# EAGLE design capmodule (EAGLE 8.2.1)
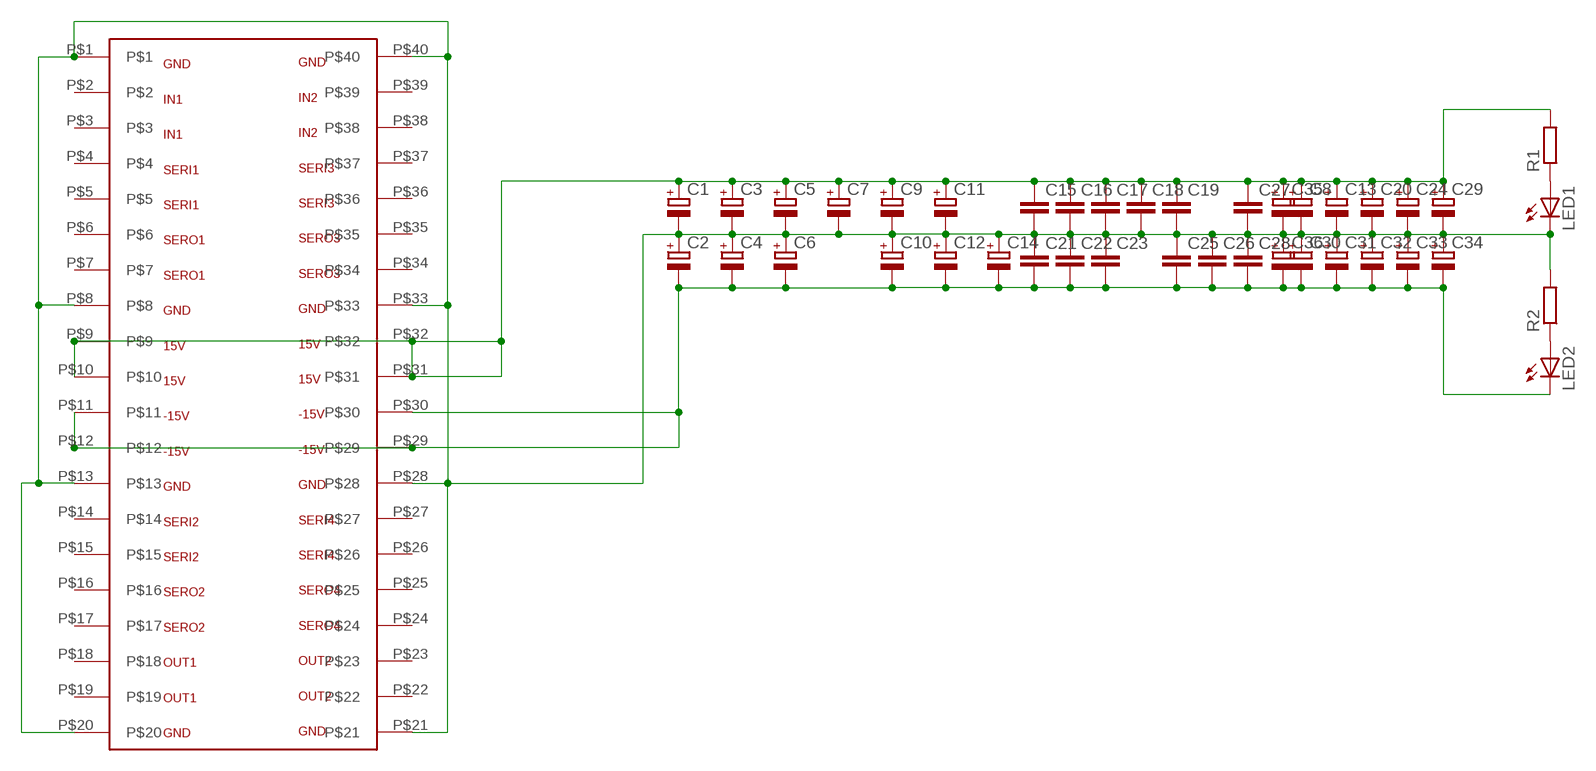
[diagram p0: schematic, sheet 1]

## Parts
C1  CPOL-EUE3.5-8  [E3,5-8]
C2  CPOL-EUE3.5-8  [E3,5-8]
C3  CPOL-EUE3.5-8  [E3,5-8]
C4  CPOL-EUE3.5-8  [E3,5-8]
C5  CPOL-EUE3.5-8  [E3,5-8]
C6  CPOL-EUE3.5-8  [E3,5-8]
C7  CPOL-EUE3.5-8  [E3,5-8]
C8  CPOL-EUSP-CAP-CX  [SP-CAP-CX]
C9  CPOL-EUE3.5-8  [E3,5-8]
C10  CPOL-EUE3.5-8  [E3,5-8]
C11  CPOL-EUE3.5-8  [E3,5-8]
C12  CPOL-EUE3.5-8  [E3,5-8]
C13  CPOL-EUSP-CAP-CX  [SP-CAP-CX]
C14  CPOL-EUE3.5-8  [E3,5-8]
C15  C-EU050-035X075  [C050-035X075]
C16  C-EU050-035X075  [C050-035X075]
C17  C-EU050-035X075  [C050-035X075]
C18  C-EU050-035X075  [C050-035X075]
C19  C-EU050-035X075  [C050-035X075]
C20  CPOL-EUSP-CAP-CX  [SP-CAP-CX]
C21  C-EU050-035X075  [C050-035X075]
C22  C-EU050-035X075  [C050-035X075]
C23  C-EU050-035X075  [C050-035X075]
C24  CPOL-EUSP-CAP-CX  [SP-CAP-CX]
C25  C-EU050-035X075  [C050-035X075]
C26  C-EU050-035X075  [C050-035X075]
C27  C-EU050-035X075  [C050-035X075]
C28  C-EU050-035X075  [C050-035X075]
C29  CPOL-EUSP-CAP-CX  [SP-CAP-CX]
C30  CPOL-EUSP-CAP-CX  [SP-CAP-CX]
C31  CPOL-EUSP-CAP-CX  [SP-CAP-CX]
C32  CPOL-EUSP-CAP-CX  [SP-CAP-CX]
C33  CPOL-EUSP-CAP-CX  [SP-CAP-CX]
C34  CPOL-EUSP-CAP-CX  [SP-CAP-CX]
C35  CPOL-EUSP-CAP-CX  [SP-CAP-CX]
C36  CPOL-EUSP-CAP-CX  [SP-CAP-CX]
LED1  LEDSML1206  [SML1206]
LED2  LEDSML1206  [SML1206]
R1  R-EU_MELF0204W  [MINI_MELF-0204W]
R2  R-EU_MELF0204W  [MINI_MELF-0204W]
U$1  VDACA  [VDACA]

## Nets
15V: C1.+ C3.+ C5.+ C7.+ C8.+ C9.+ C11.+ C13.+ C15.1 C16.1 C17.1 C18.1 C19.1 C20.+ C24.+ C27.1 C29.+ C35.+ R1.2 U$1.P$9 U$1.P$10 U$1.P$31 U$1.P$32
-15V: C2.- C4.- C6.- C10.- C12.- C14.- C21.2 C22.2 C23.2 C25.2 C26.2 C28.2 C30.- C31.- C32.- C33.- C34.- C36.- LED2.C U$1.P$11 U$1.P$12 U$1.P$29 U$1.P$30
GND: C1.- C2.+ C3.- C4.+ C5.- C6.+ C7.- C8.- C9.- C10.+ C11.- C12.+ C13.- C14.+ C15.2 C16.2 C17.2 C18.2 C19.2 C20.- C21.1 C22.1 C23.1 C24.- C25.1 C26.1 C27.2 C28.1 C29.- C30.+ C31.+ C32.+ C33.+ C34.+ C35.- C36.+ LED1.C R2.2 U$1.P$1 U$1.P$8 U$1.P$13 U$1.P$20 U$1.P$21 U$1.P$28 U$1.P$33 U$1.P$40
N$1: LED1.A R1.1
N$2: LED2.A R2.1
Unconnected: U$1.P$2 U$1.P$3 U$1.P$4 U$1.P$5 U$1.P$6 U$1.P$7 U$1.P$14 U$1.P$15 U$1.P$16 U$1.P$17 U$1.P$18 U$1.P$19 U$1.P$22 U$1.P$23 U$1.P$24 U$1.P$25 U$1.P$26 U$1.P$27 U$1.P$34 U$1.P$35 U$1.P$36 U$1.P$37 U$1.P$38 U$1.P$39

## Library data of the parts
C1-C14 C20 C24 C29-C36 = Vwvwbg:CPOL-EU: POLARIZED CAPACITOR, European symbol
C15-C19 C21-C23 C25-C28 = Vwvwbg:C-EU: CAPACITOR, European symbol
LED1 LED2 = led:LED: LED OSRAM: - CHIPLED LG R971, LG N971, LY N971, LG Q971, LY Q971, LO R971, LY R971 LH N974, LH R974 LS Q976, LO Q976, LY Q976 LO Q996 - Hyper CHIPLED LW Q18S LB Q993, LB Q99A, LB R99A - SideLED LS A670, LO A670, LY A670, LG A670, LP A670 LB A673, LV A673, LT A673, LW A673 LH A674 LY A675 LS A676, LA A676, LO A676, LY A676, LW A676 LS A679, LY A679, LG A679 - Hyper Micro SIDELED® LS Y876, LA Y876, LO Y876, LY Y876 LT Y87S - SmartLED LW L88C, LW L88S LB L89C, LB L89S, LG L890 LS L89K, LO L89K, LY L89K LS L896, LA L896, LO L896, LY L896 - TOPLED LS T670, LO T670, LY T670, LG T670, LP T670 LSG T670, LSP T670, LSY T670, LOP T670, LYG T670 LG T671, LOG T671, LSG T671 LB T673, LV T673, LT T673, LW T673 LH T674 LS T676, LA T676, LO T676, LY T676, LB T676, LH T676, LSB T676, LW T676 LB T67C, LV T67C, LT T67C, LS T67K, LO T67K, LY T67K, LW E67C LS E67B, LA E67B, LO E67B, LY E67B, LB E67C, LV E67C, LT E67C LW T67C LS T679, LY T679, LG T679 LS T770, LO T770, LY T770, LG T770, LP T770 LB T773, LV T773, LT T773, LW T773 LH T774 LS E675, LA E675, LY E675, LS T675 LS T776, LA T776, LO T776, LY T776, LB T776 LHGB T686 LT T68C, LB T68C - Hyper Mini TOPLED® LB M676 - Mini TOPLED Santana® LG M470 LS M47K, LO M47K, LY M47K Source: http://www.osram.convergy.de LUXEON: - LUMILED® LXK2-PW12-R00, LXK2-PW12-S00, LXK2-PW14-U00, LXK2-PW14-V00 LXK2-PM12-R00, LXK2-PM12-S00, LXK2-PM14-U00 LXK2-PE12-Q00, LXK2-PE12-R00, LXK2-PE12-S00, LXK2-PE14-T00, LXK2-PE14-U00 LXK2-PB12-K00, LXK2-PB12-L00, LXK2-PB12-M00, LXK2-PB14-N00, LXK2-PB14-P00, LXK2-PB14-Q00 LXK2-PR12-L00, LXK2-PR12-M00, LXK2-PR14-Q00, LXK2-PR14-R00 LXK2-PD12-Q00, LXK2-PD12-R00, LXK2-PD12-S00 LXK2-PH12-R00, LXK2-PH12-S00 LXK2-PL12-P00, LXK2-PL12-Q00, LXK2-PL12-R00 Source: www.luxeon.com KINGBRIGHT: KA-3528ASYC Source: www.kingbright.com
R1 R2 = Vwvwbg:R-EU_: RESISTOR, European symbol
U$1 = Vwvwbg:VDACA

## Board
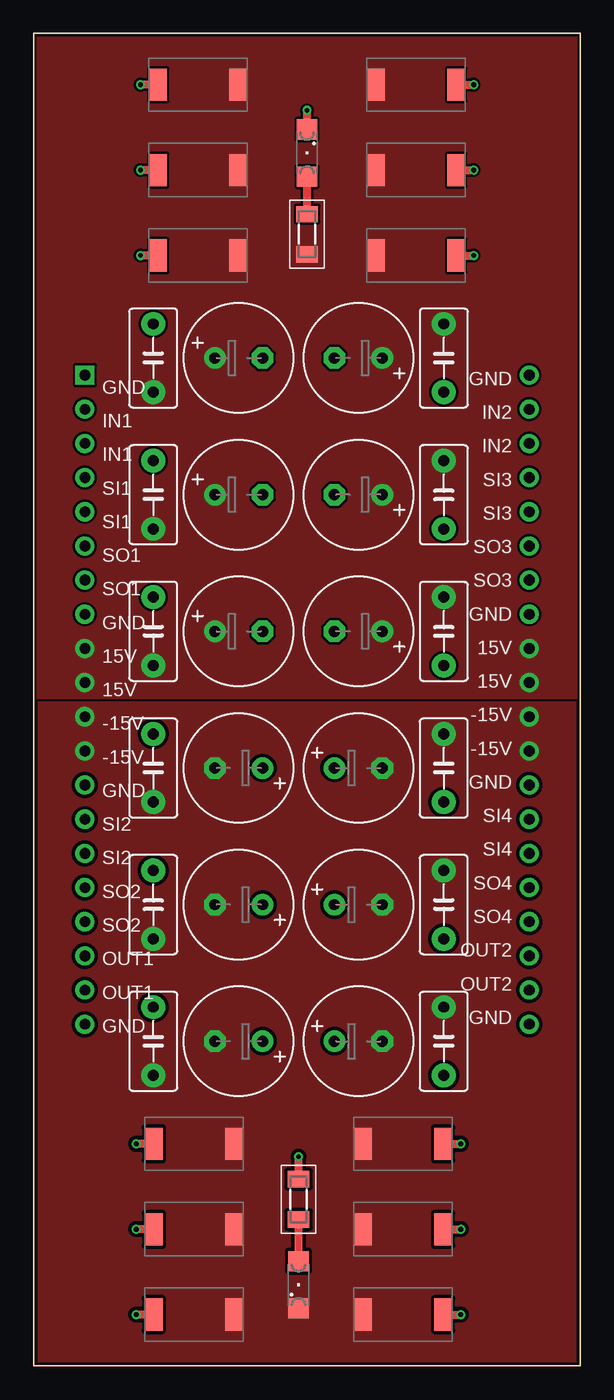
[diagram p1: board, top side]
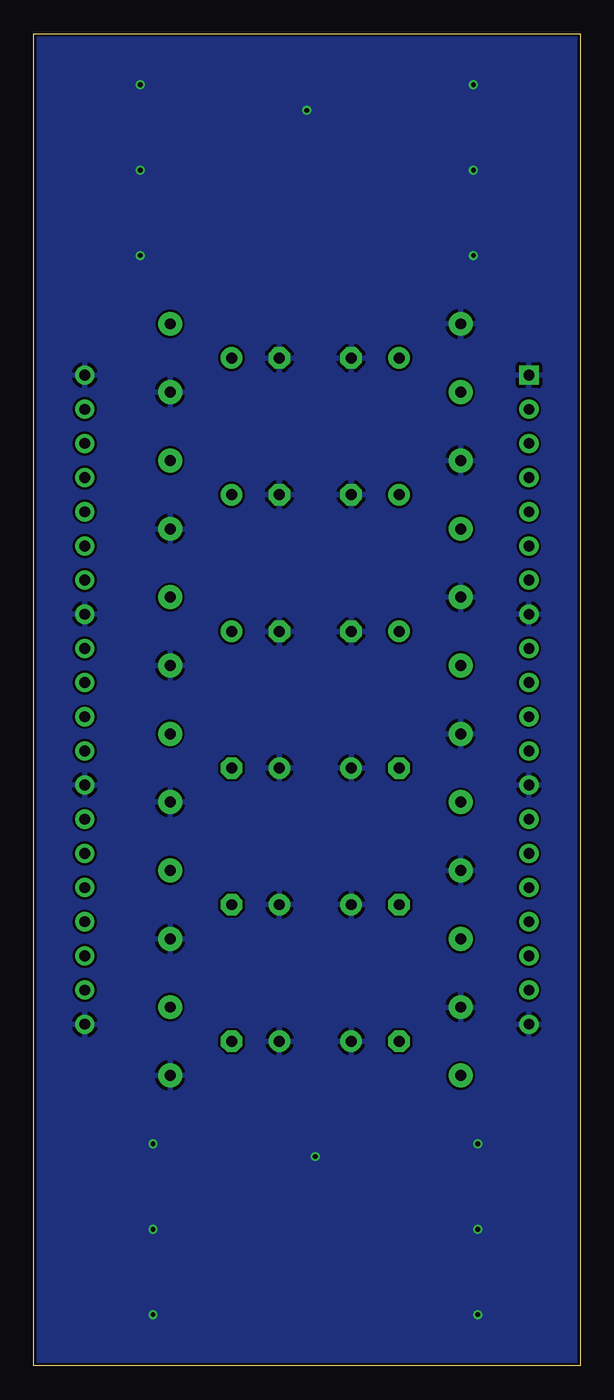
[diagram p2: board, bottom side, seen from below]

Size 40.62 x 99.05 mm. Coordinates in mm from the lower left corner, seen from the top.
Outline: 0,0 40.62,0 40.62,99.05 0,99.05 0,0
Copper layers (1*16): Top 0.035mm / dielectric 1.5mm / Bottom 0.035mm
Design rules "default": minimum track width 6mil, minimum drill 0.3mm, track to track 7mil, track to pad 7mil, pad to pad 7mil, via to via 7mil, smd to smd 7mil, copper to edge 8mil, drill to drill 8mil, minimum pad ring 6mil, minimum via ring 6mil, stop-mask expansion 4mil, vias tented up to drill 0mil, thermal gap 10mil

### Footprints (pad centres in the part's own frame; a part is rotated, then mirrored left to right if it is on the bottom)
E3,5-8 = drill 0.813 pad 1.6: + -1.778,0 | drill 0.813 pad 1.6 octagon: - 1.778,0
SP-CAP-CX = smd 1.3 x 2.4: + -2.5,0; - 3.453,0
C050-035X075 = drill 0.813 pad 1.778: 1 -2.54,0; 2 2.54,0
SML1206 = smd 1.5 x 1.5: A 1.75,0; C -1.75,0
MINI_MELF-0204W = smd 1.2 x 1.6: 1 -1.5,0; 2 1.5,0
VDACA = drill 0.8 pad 1.422 square: P$1 1.27,-19.05 | drill 0.8 pad 1.422: P$2 1.27,-21.59; P$3 1.27,-24.13; P$4 1.27,-26.67; P$5 1.27,-29.21; P$6 1.27,-31.75; P$7 1.27,-34.29; P$8 1.27,-36.83; P$9 1.27,-39.37; P$10 1.27,-41.91; P$11 1.27,-44.45; P$12 1.27,-46.99; P$13 1.27,-49.53; P$14 1.27,-52.07; P$15 1.27,-54.61; P$16 1.27,-57.15; P$17 1.27,-59.69; P$18 1.27,-62.23; P$19 1.27,-64.77; P$20 1.27,-67.31; P$21 34.29,-67.31; P$22 34.29,-64.77; P$23 34.29,-62.23; P$24 34.29,-59.69; P$25 34.29,-57.15; P$26 34.29,-54.61; P$27 34.29,-52.07; P$28 34.29,-49.53; P$29 34.29,-46.99; P$30 34.29,-44.45; P$31 34.29,-41.91; P$32 34.29,-39.37; P$33 34.29,-36.83; P$34 34.29,-34.29; P$35 34.29,-31.75; P$36 34.29,-29.21; P$37 34.29,-26.67; P$38 34.29,-24.13; P$39 34.29,-21.59; P$40 34.29,-19.05

### Placement (x,y rotation side)
C1  15.24,74.93 0 top
C2  24.13,44.45 0 top
C3  15.24,64.77 0 top
C4  24.13,34.29 0 top
C5  15.24,54.61 0 top
C6  24.13,24.13 0 top
C7  24.13,54.61 180 top
C8  27.94,88.9 0 top
C9  24.13,64.77 180 top
C10  15.24,24.13 180 top
C11  24.13,74.93 180 top
C12  15.24,34.29 180 top
C13  27.94,82.55 0 top
C14  15.24,44.45 180 top
C15  8.89,64.77 90 top
C16  8.89,54.61 90 top
C17  30.48,54.61 270 top
C18  30.48,64.77 270 top
C19  30.48,74.93 270 top
C20  27.94,95.25 0 top
C21  8.89,44.45 270 top
C22  30.48,34.29 90 top
C23  30.48,24.13 90 top
C24  12.7,88.9 180 top
C25  8.89,24.13 270 top
C26  8.89,34.29 270 top
C27  8.89,74.93 90 top
C28  30.48,44.45 90 top
C29  12.7,82.55 180 top
C30  27.94,10.16 180 top
C31  27.94,16.51 180 top
C32  11.43,3.81 0 top
C33  11.43,10.16 0 top
C34  11.43,16.51 0 top
C35  12.7,95.25 180 top
C36  27.94,3.81 180 top
LED1  20.32,90.17 270 top
LED2  19.68,6.03 90 top
R1  20.32,84.14 270 top
R2  19.68,12.38 90 top
U$1  2.54,92.71 0 top

### Tracks (layer width: path | path; a pad name or v marks a point on that pad's centre or on a via)
15V
  pour Top (rank 2, no thermals): -1.27,48.9 44.77,48.9 44.45,104.14 -1.27,104.14
-15V
  pour Top (isolate 0.254, no thermals): -3.49,49.21 49.85,49.21 49.53,-3.81 -3.81,-3.81
GND  (via drill 0.35)
  Top 0.61: LED1.C v20.32,93.34 | C20.- v32.7,95.25 | C8.- v32.7,88.9 | C13.- v32.7,82.55 | C29.- v7.94,82.55 | C24.- v7.94,88.9 | C35.- v7.94,95.25 | C34.+ v7.62,16.51 | C33.+ v7.62,10.16 | C32.+ v7.62,3.81 | C31.+ v31.75,16.51 | C30.+ v31.75,10.16 | C36.+ v31.75,3.81 | R2.2 v19.68,15.56
  pour Bottom: -8.89,101.6 62.23,101.6 62.23,-11.43 -8.89,-11.43 -8.89,100.33
N$1
  Top 0.61: R1.1 LED1.A
N$2
  Top 0.61: LED2.A R2.1